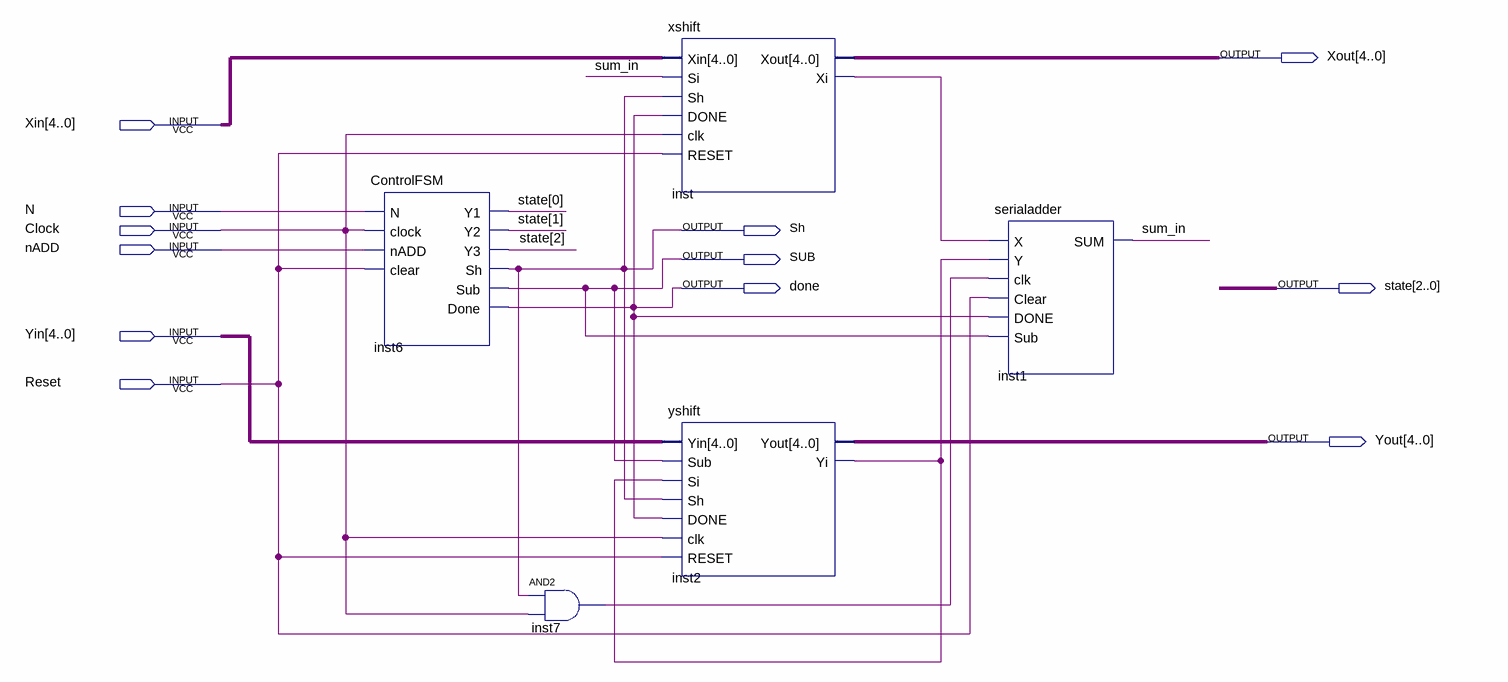
[diagram p0: schematic sheet]
// Quartus schematic BSAS5B.bdf as structural Verilog: 5 symbols, 12 pins
module BSAS5B (
  input  [4:0] Xin,
  input  N,
  input  Clock,
  input  nADD,
  input  [4:0] Yin,
  input  Reset,
  output [4:0] Xout,
  output Sh,
  output SUB,
  output done,
  output [2:0] state,
  output [4:0] Yout
);

  wire inst2_yi, inst7_out, inst_xi, sum_in;

  ControlFSM inst6 (
    .N(N), .clock(Clock), .nADD(nADD), .clear(Reset), .Y1(state[0]), .Y2(state[1]), .Y3(state[2]), .Sh(Sh),
    .Sub(SUB), .Done(done));
  and inst7 (inst7_out, Sh, Clock);
  xshift inst (.Xin(Xin), .Si(sum_in), .Sh(Sh), .DONE(done), .clk(Clock), .RESET(Reset), .Xout(Xout), .Xi(inst_xi));
  yshift inst2 (
    .Yin(Yin), .Sub(SUB), .Si(inst2_yi), .Sh(Sh), .DONE(done), .clk(Clock), .RESET(Reset), .Yout(Yout),
    .Yi(inst2_yi));
  serialadder inst1 (.X(inst_xi), .Y(inst2_yi), .clk(inst7_out), .Clear(Reset), .DONE(done), .Sub(SUB), .SUM(sum_in));
endmodule
